# Altium schematic sheet Digit_Board.SchDoc
size A
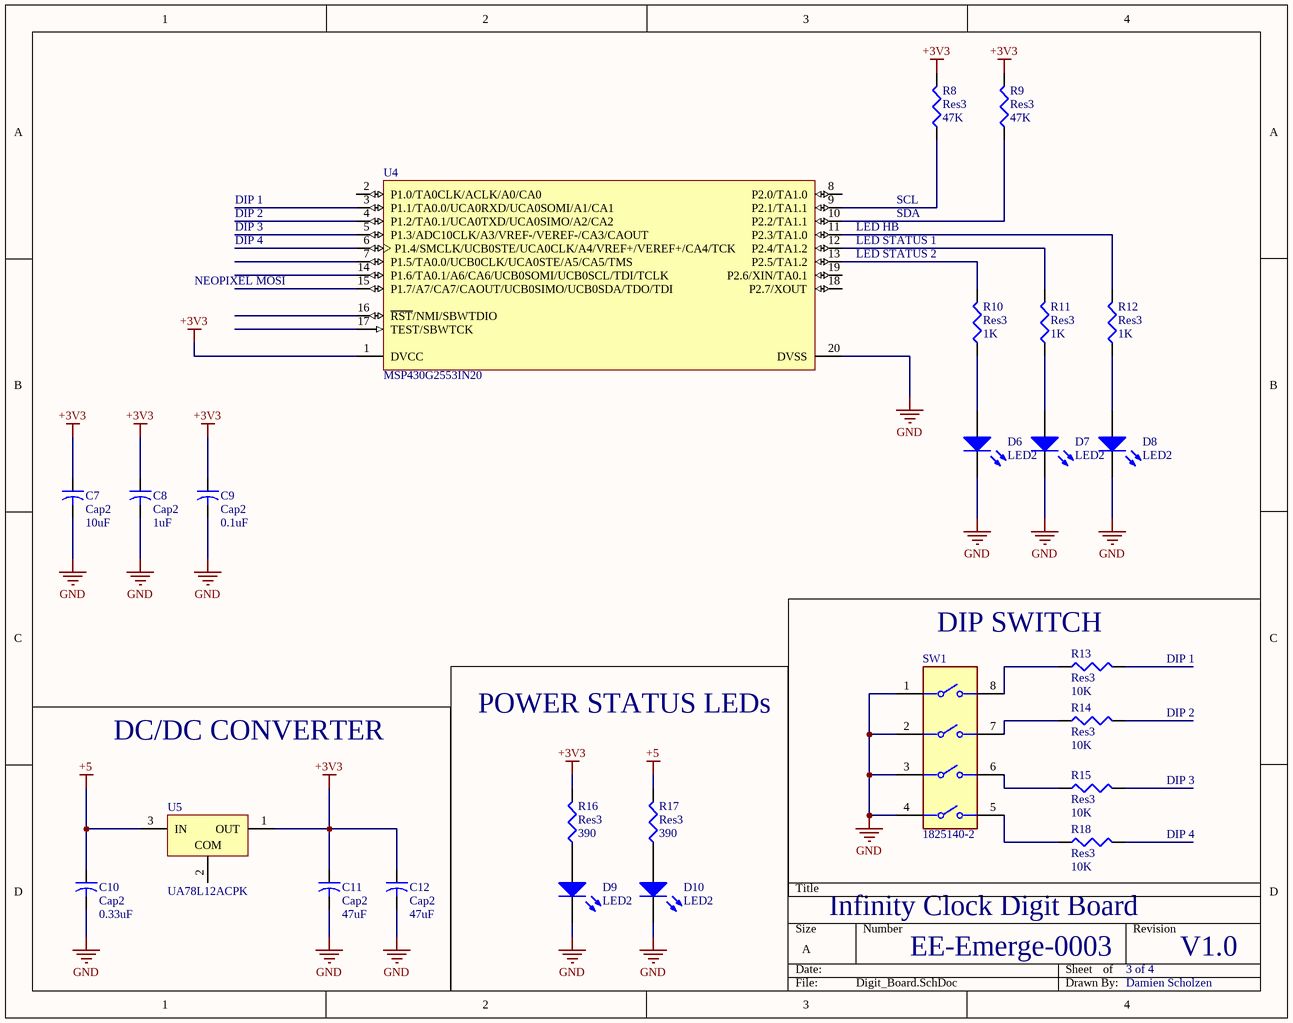
[diagram p0: Digit_Board.SchDoc]

## Parts
C7  Cap2  value 10uF  [C0805]
C8  Cap2  value 1uF  [C0805]
C9  Cap2  value 0.1uF  [C0805]
C10  Cap2  value 0.33uF  [C0805]
C11  Cap2  value 47uF  [C0805]
C12  Cap2  value 47uF  [C0805]
D6  LED2  [3.2X1.6X1.1]
D7  LED2  [3.2X1.6X1.1]
D8  LED2  [3.2X1.6X1.1]
D9  LED2  [3.2X1.6X1.1]
D10  LED2  [3.2X1.6X1.1]
R8  Res3  value 47K  [6-0805_N]
R9  Res3  value 47K  [6-0805_N]
R10  Res3  value 1K  [6-0805_N]
R11  Res3  value 1K  [6-0805_N]
R12  Res3  value 1K  [6-0805_N]
R13  Res3  value 10K  [6-0805_N]
R14  Res3  value 10K  [6-0805_N]
R15  Res3  value 10K  [6-0805_N]
R16  Res3  value 390  [6-0805_N]
R17  Res3  value 390  [6-0805_N]
R18  Res3  value 10K  [6-0805_N]
SW1  1825140-2  [FP-1825140-2-MFG]
U4  MSP430G2553IN20  [N0020A]
U5  UA78L12ACPK  [PK0003A_M]

## Nets
+3V3: C7.1 C8.1 C9.1 C11.1 C12.1 R8.2 R9.2 R16.2 U4.1(DVCC) U5.1(OUT)
+5: C10.1 R17.2 U5.3(IN)
GND: C7.2 C8.2 C9.2 C10.2 C11.2 C12.2 D6.2(K) D7.2(K) D8.2(K) D9.2(K) D10.2(K) SW1.1 SW1.2 SW1.3 SW1.4 U4.20(DVSS)
NetD6_1: D6.1(A) R10.1
NetD7_1: D7.1(A) R11.1
NetD8_1: D8.1(A) R12.1
NetD9_1: D9.1(A) R16.1
NetD10_1: D10.1(A) R17.1
NetR8_1: R8.1 U4.9(P2.1/TA1.1)
NetR9_1: R9.1 U4.10(P2.2/TA1.1)
NetR10_2: R10.2 U4.13(P2.5/TA1.2)
NetR11_2: R11.2 U4.12(P2.4/TA1.2)
NetR12_2: R12.2 U4.11(P2.3/TA1.0)
NetR13_1: R13.1 SW1.8
NetR14_1: R14.1 SW1.7
NetR15_1: R15.1 SW1.6
NetR18_1: R18.1 SW1.5

Not connected (* = marked no-connect by the designer): R13 2; R14 2; R15 2; R18 2; U4 2(P1.0/TA0CLK/ACLK/A0/CA0) 3(P1.1/TA0.0/UCA0RXD/UCA0SOMI/A1/CA1) 4(P1.2/TA0.1/UCA0TXD/UCA0SIMO/A2/CA2) 5(P1.3/ADC10CLK/A3/VREF-/VEREF-/CA3/CAOUT) 6(P1.4/SMCLK/UCB0STE/UCA0CLK/A4/VREF+/VEREF+/CA4/TCK) 7(P1.5/TA0.0/UCB0CLK/UCA0STE/A5/CA5/TMS) 8(P2.0/TA1.0) 14(P1.6/TA0.1/A6/CA6/UCB0SOMI/UCB0SCL/TDI/TCLK) 15(P1.7/A7/CA7/CAOUT/UCB0SIMO/UCB0SDA/TDO/TDI) 16(~{RST}/NMI/SBWTDIO) 17(TEST/SBWTCK) 18(P2.7/XOUT) 19(P2.6/XIN/TA0.1); U5 2(COM)

## Notes on the sheet
- DIP 1
- DIP 2
- DIP 3
- (near U4) LED HB
- SCL
- SDA
- NEOPIXEL MOSI
- DIP 4
- (near U4) LED STATUS 1
- LED STATUS 2
- (near R13) DIP SWITCH
- DC/DC CONVERTER
- POWER STATUS LEDs
- Infinity Clock Digit Board
- EE-Emerge-0003
- 3 of 4
- V1.0
- Damien Scholzen

## Library data of the parts
C7 = Cap2: Capacitor; Published: 23-Sep-2002; PackageReference: CAPR5-4X5; Publisher: Altium Limited; PackageDescription: Capacitor; 2 Leads
C8 = Cap2_1: Capacitor; Published: 23-Sep-2002; PackageReference: CAPR5-4X5; Publisher: Altium Limited; PackageDescription: Capacitor; 2 Leads
C9 = Cap2_2: Capacitor; Published: 23-Sep-2002; PackageReference: CAPR5-4X5; Publisher: Altium Limited; PackageDescription: Capacitor; 2 Leads
C10 = Cap2_4: Capacitor; Published: 23-Sep-2002; PackageReference: CAPR5-4X5; Publisher: Altium Limited; PackageDescription: Capacitor; 2 Leads
C11 C12 = Cap2_5: Capacitor; Published: 23-Sep-2002; PackageReference: CAPR5-4X5; Publisher: Altium Limited; PackageDescription: Capacitor; 2 Leads
D6-D10 = LED2: Typical RED, GREEN, YELLOW, AMBER GaAs LED; Published: 8-Jun-2000; LatestRevisionDate: 17-Jul-2002; LatestRevisionNote: Re-released for DXP Platform.; PackageVersion: Feb-2002; PackageReference: 3.2X1.6X1.1; Publisher: Altium Limited; PackageDescription: SM LED; 2 Flat Leads
R8 R9 = Res3_1: Resistor; Published: 8-Jun-2000; LatestRevisionDate: 29-May-2009; LatestRevisionNote: IPC-7351 Footprint Added.; PackageReference: J1-0603; Publisher: Altium Limited; PackageDescription: Chip Resistor
R10-R12 = Res3_2: Resistor; Published: 8-Jun-2000; LatestRevisionDate: 29-May-2009; LatestRevisionNote: IPC-7351 Footprint Added.; PackageReference: J1-0603; Publisher: Altium Limited; PackageDescription: Chip Resistor
R13-R15 R18 = Res3_3: Resistor; Published: 8-Jun-2000; LatestRevisionDate: 29-May-2009; LatestRevisionNote: IPC-7351 Footprint Added.; PackageReference: J1-0603; Publisher: Altium Limited; PackageDescription: Chip Resistor
R16 R17 = Res3_4: Resistor; Published: 8-Jun-2000; LatestRevisionDate: 29-May-2009; LatestRevisionNote: IPC-7351 Footprint Added.; PackageReference: J1-0603; Publisher: Altium Limited; PackageDescription: Chip Resistor
SW1 = CMP-03400-000052-1: SWITCH SLIDE DIP SPST 25MA 24V; Pitch: 1.27mm; Actuator Type: Standard; Actuator Length: 0mm; Contact Current Rating: 100mA; Voltage Rating (DC): 50V; Electrical Life: 1000Cycles; Sealable: No (Without); Contact Resistance: 100mR; Washable: No; Number of Positions: 4; Actuator Material: Polymer; Max Current Rating: 25mA; Max Voltage Rating (DC): 24V; Series: MGDH; Housing Material: Polyphenylene; Length: 0.244inch; Package Quantity: 2000; Max Operating Temperature: 85°C; Contact Plating: Gold; Contact Material: Copper Alloy; Throw Configuration: SPST; Height: 1.7mm; Orientation: Straight; Housing Color: Black; Type: Switch; Mount: Surface Mount; Terminal Pitch: 1.27mm; Flammability Rating: UL94 V-0; Radiation Hardening: No; Packaging: Tape and Reel; Termination: Gull Wing; Min Operating Temperature: -30°C; RoHS Compliant: Yes
U4 = CMP-0365-00184-2: 16 MHz Mixed Signal Microcontroller with 16 KB Flash, 512 B SRAM and 24 GPIOs, -40 to 85 degC, 20-pin DIP (N), Pb-Free (RoHS); Manufacturer: Texas Instruments; USCI_B (I2C & SPI): 1; Temp Sensor: Yes; SubFamily: Value Line; Frequency(MHz): 16; ADC Channels: 8; SRAM(B): 512; ADC: 10-bit SAR; GPIO: 24; Timers - 16-bit: 2; Code_JEDEC: MS-001; Eco-Plan: Pb-Free (RoHS); PartNumber: MSP430G2553IN20; ComponentLink1URL: http://www.ti.com/; PackageVersion: 4040049/E; Comparators: Yes; Watchdog: Yes; ComponentLink2Description: Datasheet; ComponentLink1Description: Manufacturer URL; Mounting Technology: Through Hole; ComponentLink2URL: http://www.ti.com/general/docs/lit/getliterature.tsp?genericPartNumber=MSP430G2553&fileType=pdf; Brown Out Reset: Yes; PackageReference: N0020A; PackageDescription: 20-Pin Plastic In-Line, Body 25.40 x 6.35 mm, Pitch 2.54 mm; ComponentLink3URL: http://www.ti.com/litv/pdf/mpds177g; ComponentLink3Description: Package Specification; Flash(KB): 16; Cap touch I/O: Yes; USCI_A (UART/LIN/IrDA/SPI): 1; DatasheetVersion: SLAS735G; Manufacturer 1: Texas Instruments; Manufacturer Part Number 1: MSP430G2553IN20
U5 = CMP-0324-00094-3: Regulator with 14.5 to 27 V Input and 12 V Output, 0 to 125 degC, 3-Pin SOT-89 (PK), Green (RoHS & no Sb/Br); Manufacturer 1: Texas Instruments; SubFamily: Standard Voltage Regulator; Vin(Max)(V): 27; Vin(Min)(V): 14.5; Vout(Max)(V): 12; Iq(Typ)(mA): 6; Iout(Max)(A): 0.1; PackageDescription: 3-Pin Plastic Small Outline, Body 2.5 x 4.5 mm, Pitch 1.5 mm; PackageVersion: 4040234/D, 02/2006; Eco-Plan: Green (RoHS & no Sb/Br); Mounting Technology: Through Hole; Code_JEDEC: TO-243; PartNumber: UA78L12ACPK; DatasheetVersion: SLVS010S; PackageReference: PK0003A; Vout(Min)(V): 12; Manufacturer Part Number 1: UA78L12ACPK